# EAGLE design main (EAGLE 6.6.0)
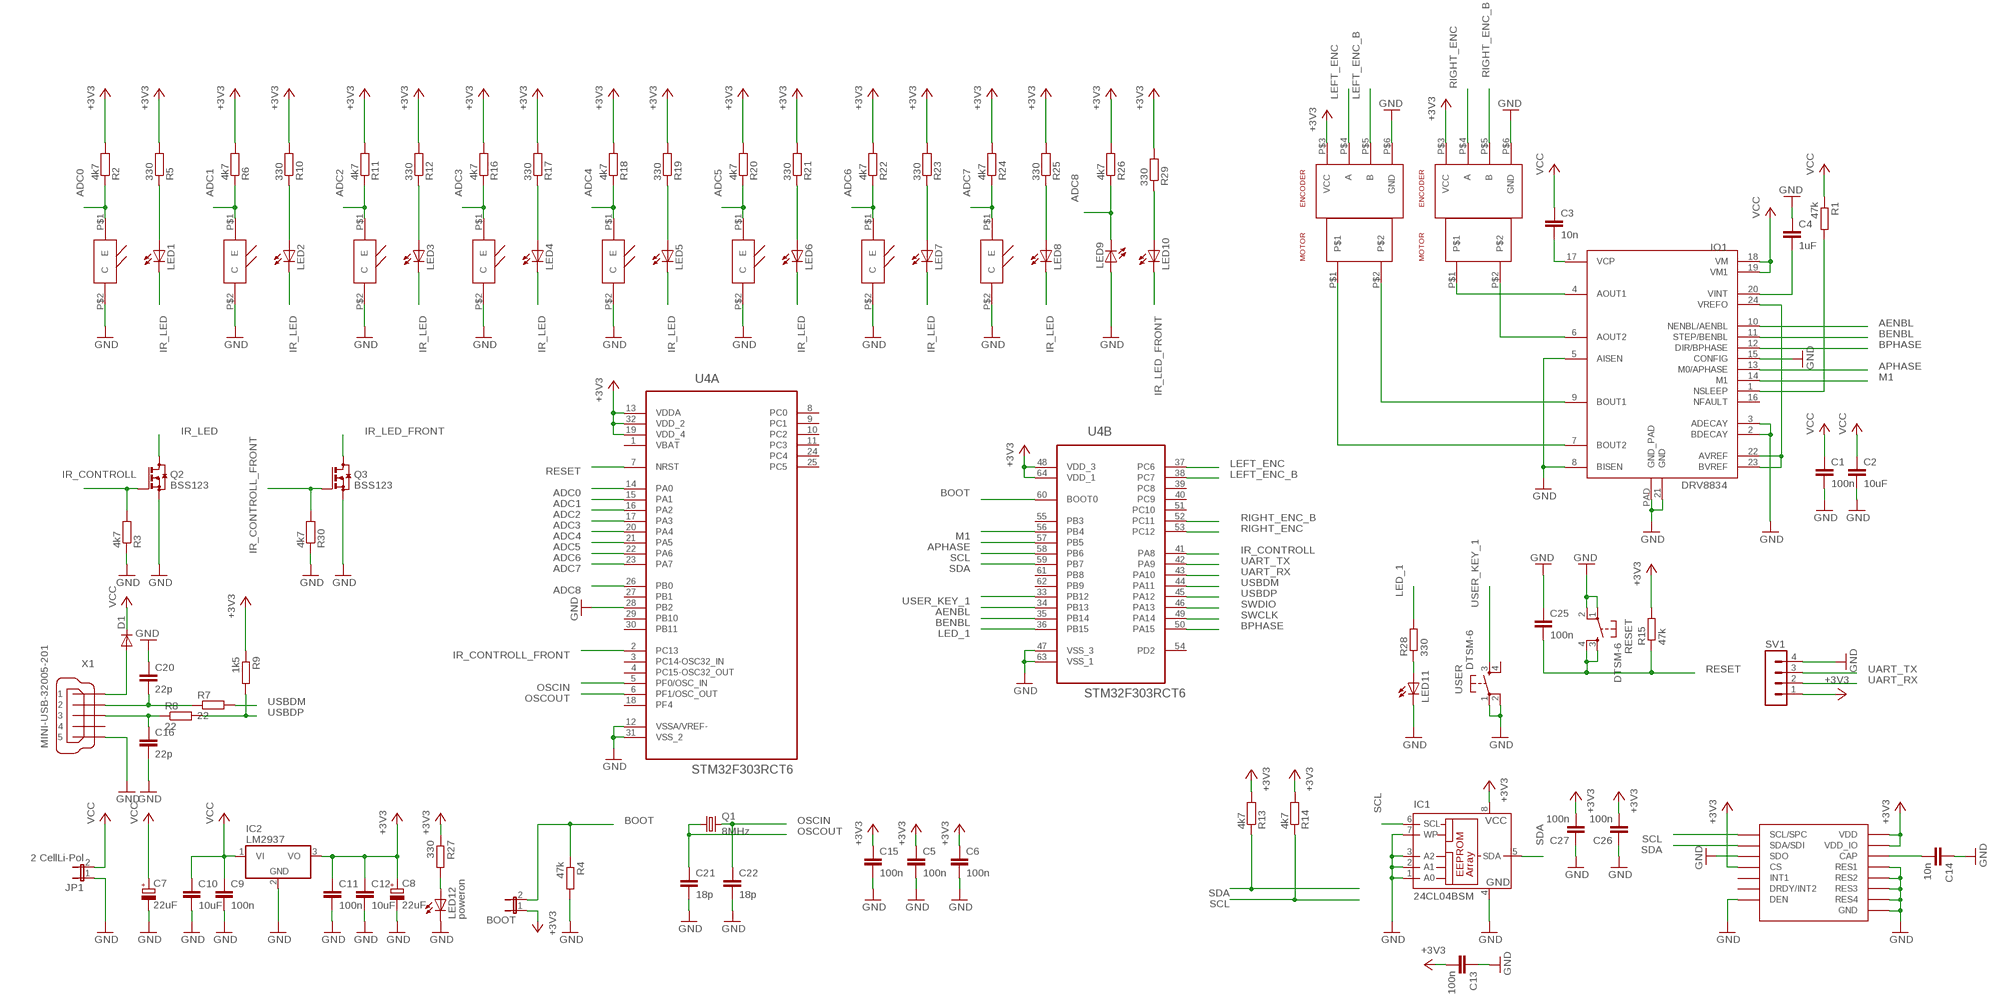
[diagram p0: schematic, sheet 1]

## Parts
BOOT  JP1E  [JP1]
C1  100n  C-EUC1206  [C1206]
C2  10uF  C-EUC1206  [C1206]
C3  10n  C-EUC1206  [C1206]
C4  1uF  C-EUC1206  [C1206]
C5  100n  C-EUC0805  [C0805]
C6  100n  C-EUC0805  [C0805]
C7  22uF  CPOL-EU153CLV-0505  [153CLV-0505]
C8  22uF  CPOL-EU153CLV-0505  [153CLV-0505]
C9  100n  C-EUC0805  [C0805]
C10  10uF  C-EUC0805  [C0805]
C11  100n  C-EUC0805  [C0805]
C12  10uF  C-EUC0805  [C0805]
C13  100n  C-EUC0805  [C0805]
C14  10n  C-EUC0805  [C0805]
C15  100n  C-EUC0805  [C0805]
C16  22p  C-EUC0805  [C0805]
C20  22p  C-EUC0805  [C0805]
C21  18p  C-EUC0805  [C0805]
C22  18p  C-EUC0805  [C0805]
C25  100n  C-EUC0805  [C0805]
C26  100n  C-EUC0805  [C0805]
C27  100n  C-EUC0805  [C0805]
D1  DIODE-SMB  [SMB]
IC1  24CL04BSM  [SO-08M]
IC2  LM2937  [TO263-3]
IO1  DRV8834  [DRV8834_PCK]
JP1  2 CellLi-Pol  JP1E  [JP1]
LED1  LEDCHIPLED_1206  [CHIPLED_1206]
LED2  LEDCHIPLED_1206  [CHIPLED_1206]
LED3  LEDCHIPLED_1206  [CHIPLED_1206]
LED4  LEDCHIPLED_1206  [CHIPLED_1206]
LED5  LEDCHIPLED_1206  [CHIPLED_1206]
LED6  LEDCHIPLED_1206  [CHIPLED_1206]
LED7  LEDCHIPLED_1206  [CHIPLED_1206]
LED8  LEDCHIPLED_1206  [CHIPLED_1206]
LED9  LED5MM  [LED5MM]
LED10  LED5MM  [LED5MM]
LED11  LEDCHIPLED_1206  [CHIPLED_1206]
LED12  poweron  LEDCHIPLED_1206  [CHIPLED_1206]
LSM6DS0  L3GD20H  [LGA16L]
Q1  8MHz  CRYSTALCTS406  [CTS406]
Q2  BSS123  [SOT23]
Q3  BSS123  [SOT23]
R1  47k  R-EU_M1206  [M1206]
R2  4k7  R-EU_M0805  [M0805]
R3  4k7  R-EU_M0805  [M0805]
R4  47k  R-EU_M0805  [M0805]
R5  330  R-EU_M0805  [M0805]
R6  4k7  R-EU_M0805  [M0805]
R7  22  R-EU_M0805  [M0805]
R8  22  R-EU_M0805  [M0805]
R9  1k5  R-EU_M0805  [M0805]
R10  330  R-EU_M0805  [M0805]
R11  4k7  R-EU_M0805  [M0805]
R12  330  R-EU_M0805  [M0805]
R13  4k7  R-EU_M0805  [M0805]
R14  4k7  R-EU_M0805  [M0805]
R15  47k  R-EU_M0805  [M0805]
R16  4k7  R-EU_M0805  [M0805]
R17  330  R-EU_M0805  [M0805]
R18  4k7  R-EU_M0805  [M0805]
R19  330  R-EU_M0805  [M0805]
R20  4k7  R-EU_M0805  [M0805]
R21  330  R-EU_M0805  [M0805]
R22  4k7  R-EU_M0805  [M0805]
R23  330  R-EU_M0805  [M0805]
R24  4k7  R-EU_M0805  [M0805]
R25  330  R-EU_M0805  [M0805]
R26  4k7  R-EU_M0805  [M0805]
R27  330  R-EU_M0805  [M0805]
R28  330  R-EU_M0805  [M0805]
R29  330  R-EU_M0805  [M0805]
R30  4k7  R-EU_M0805  [M0805]
RESET  DTSM-6  [DTSM-6]
SV1  MA04-1  [MA04-1]
U4  STM32F303RCT6  [QFP50P1200X1200X160-64N]
U$3  SFH3710  [SFH3710]
U$4  SFH3710  [SFH3710]
U$5  SFH3710  [SFH3710]
U$6  SFH3710  [SFH3710]
U$7  SFH3710  [SFH3710]
U$8  SFH3710  [SFH3710]
U$9  SFH3710  [SFH3710]
U$10  SFH3710  [SFH3710]
U$11  POLOLU_GEAR_MOTORPOLO  [POLOLU_GEAR_MOTOR]
U$12  POLOLU_GEAR_MOTORPOLO  [POLOLU_GEAR_MOTOR]
USER  DTSM-6  [DTSM-6]
X1  MINI-USB-32005-201  [32005-201]

## Nets
+3V3: BOOT.1 C5.1 C6.1 C8.+ C11.1 C12.1 C13.2 C15.1 C26.2 C27.2 IC1.8(VCC) IC2.3(VO) LSM6DS0.P$1(VDD_IO) LSM6DS0.P$5(CS) LSM6DS0.P$16(VDD) R2.2 R5.2 R6.2 R9.1 R10.2 R11.2 R12.2 R13.2 R14.2 R15.2 R16.2 R17.2 R18.2 R19.2 R20.2 R21.2 R22.2 R23.2 R24.2 R25.2 R26.2 R27.1 R29.2 SV1.1 U4.13(A:VDDA) U4.19(A:VDD_4) U4.32(A:VDD_2) U4.48(B:VDD_3) U4.64(B:VDD_1) U$11.P$3(VCC) U$12.P$3(VCC)
ADC0: R2.1 U4.14(A:PA0) U$3.P$1(E)
ADC1: R6.1 U4.15(A:PA1) U$4.P$1(E)
ADC2: R11.1 U4.16(A:PA2) U$5.P$1(E)
ADC3: R16.1 U4.17(A:PA3) U$6.P$1(E)
ADC4: R18.1 U4.20(A:PA4) U$7.P$1(E)
ADC5: R20.1 U4.21(A:PA5) U$8.P$1(E)
ADC6: R22.1 U4.22(A:PA6) U$9.P$1(E)
ADC7: R24.1 U4.23(A:PA7) U$10.P$1(E)
ADC8: LED9.K(C) R26.1 U4.26(A:PB0)
AENBL: IO1.10(NENBL/AENBL) U4.34(B:PB13)
APHASE: IO1.13(M0/APHASE) U4.57(B:PB5)
BENBL: IO1.11(STEP/BENBL) U4.35(B:PB14)
BOOT: BOOT.2 R4.1 U4.60(B:BOOT0)
BPHASE: IO1.12(DIR/BPHASE) U4.50(B:PA15)
GND: C1.2 C2.2 C4.1 C5.2 C6.2 C7.- C8.- C9.2 C10.2 C11.2 C12.2 C13.1 C14.1 C15.2 C16.2 C20.1 C21.2 C22.2 C25.1 C26.1 C27.1 IC1.1(A0) IC1.2(A1) IC1.3(A2) IC1.4(GND) IC1.7(WP) IC2.2(GND) IO1.2(BDECAY) IO1.3(ADECAY) IO1.5(AISEN) IO1.8(BISEN) IO1.15(CONFIG) IO1.21(GND) IO1.PAD(GND_PAD) JP1.1 LED9.A LED11.C LED12.C LSM6DS0.P$4(SDO) LSM6DS0.P$8(DEN) LSM6DS0.P$9(RES1) LSM6DS0.P$10(RES2) LSM6DS0.P$11(RES3) LSM6DS0.P$12(GND) LSM6DS0.P$13(GND) LSM6DS0.P$15(RES4) Q2.2(S) Q3.2(S) R3.1 R4.2 R30.1 RESET.1 RESET.2 SV1.4 U4.12(A:VSSA/VREF-) U4.28(A:PB2) U4.31(A:VSS_2) U4.47(B:VSS_3) U4.63(B:VSS_1) U$3.P$2(C) U$4.P$2(C) U$5.P$2(C) U$6.P$2(C) U$7.P$2(C) U$8.P$2(C) U$9.P$2(C) U$10.P$2(C) U$11.P$6(GND) U$12.P$6(GND) USER.1 USER.2 X1.5
IR_CONTROLL: Q2.1(G) R3.2 U4.41(B:PA8)
IR_CONTROLL_FRONT: Q3.1(G) R30.2 U4.2(A:PC13)
IR_LED: LED1.C LED2.C LED3.C LED4.C LED5.C LED6.C LED7.C LED8.C Q2.3(D)
IR_LED_FRONT: LED10.K(C) Q3.3(D)
LED_1: R28.2 U4.36(B:PB15)
LEFT_ENC: U4.37(B:PC6) U$11.P$4(A)
LEFT_ENC_B: U4.38(B:PC7) U$11.P$5(B)
M1: IO1.14(M1) U4.56(B:PB4)
N$1: IO1.6(AOUT2) U$12.P$2
N$2: IO1.4(AOUT1) U$12.P$1
N$3: IO1.7(BOUT2) U$11.P$1
N$4: IO1.9(BOUT1) U$11.P$2
N$5: C3.2 IO1.17(VCP)
N$6: C14.2 LSM6DS0.P$14(CAP)
N$7: LED10.A R29.1
N$8: IO1.22(AVREF) IO1.23(BVREF) IO1.24(VREFO)
N$9: IO1.1(NSLEEP) R1.2
N$14: LED1.A R5.1
N$15: LED2.A R10.1
N$16: LED3.A R12.1
N$17: LED4.A R17.1
N$18: LED5.A R19.1
N$19: LED6.A R21.1
N$20: LED7.A R23.1
N$21: LED8.A R25.1
N$22: C4.2 IO1.20(VINT)
N$23: LED12.A R27.2
N$33: LED11.A R28.1
N$55: C20.2 R7.1 X1.2
N$56: C16.1 R8.1 X1.3
N$57: D1.A X1.1
OSCIN: C22.1 Q1.3 U4.5(A:PF0/OSC_IN)
OSCOUT: C21.1 Q1.1 U4.6(A:PF1/OSC_OUT)
RESET: C25.2 R15.1 RESET.3 RESET.4 U4.7(A:NRST)
RIGHT_ENC: U4.53(B:PC12) U$12.P$4(A)
RIGHT_ENC_B: U4.52(B:PC11) U$12.P$5(B)
SCL: IC1.6(SCL) LSM6DS0.P$2(SCL/SPC) R14.1 U4.58(B:PB6)
SDA: IC1.5(SDA) LSM6DS0.P$3(SDA/SDI) R13.1 U4.59(B:PB7)
SWCLK: U4.49(B:PA14)
SWDIO: U4.46(B:PA13)
UART_RX: SV1.2 U4.43(B:PA10)
UART_TX: SV1.3 U4.42(B:PA9)
USBDM: R7.2 U4.44(B:PA11)
USBDP: R8.2 R9.2 U4.45(B:PA12)
USER_KEY_1: U4.33(B:PB12) USER.3
VCC: C1.1 C2.1 C3.1 C7.+ C9.1 C10.1 D1.C IC2.1(VI) IO1.18(VM) IO1.19(VM1) JP1.2 R1.1
Unconnected: IO1.16(NFAULT) LSM6DS0.P$6(DRDY/INT2) LSM6DS0.P$7(INT1) U4.3(A:PC14-OSC32_IN) U4.4(A:PC15-OSC32_OUT) U4.8(A:PC0) U4.9(A:PC1) U4.10(A:PC2) U4.11(A:PC3) U4.18(A:PF4) U4.24(A:PC4) U4.25(A:PC5) U4.27(A:PB1) U4.29(A:PB10) U4.30(A:PB11) U4.39(B:PC8) U4.40(B:PC9) U4.51(B:PC10) U4.54(B:PD2) U4.55(B:PB3) U4.61(B:PB8) U4.62(B:PB9) USER.4 X1.4

## Power pins joined to a net without a drawn wire
VBAT: U4.1(A:VBAT)

## Library data of the parts
BOOT JP1 = jumper:JP1E: JUMPER
C1-C6 C9-C16 C20-C22 C25-C27 = resistor:C-EU: CAPACITOR, European symbol
C7 C8 = resistor:CPOL-EU: POLARIZED CAPACITOR, European symbol
D1 = diode:DIODE-: DIODE
IC1 = microchip:24*: Serial EEPROM I2C; MPN: FM24CL04-S; OC_FARNELL: 1607928; OC_NEWARK: 97H6443
IC2 = linear:LM2937: LM2937-2.5, LM2937-3.3 400mA and 500mA Voltage Regulators Source: http://cache.national.com/ds/LM/LM2937-2.5.pdf
IO1 = yellow_car:DRV8834
LED1-LED8 LED11 LED12 = led:LED: LED OSRAM: - CHIPLED LG R971, LG N971, LY N971, LG Q971, LY Q971, LO R971, LY R971 LH N974, LH R974 LS Q976, LO Q976, LY Q976 LO Q996 - Hyper CHIPLED LW Q18S LB Q993, LB Q99A, LB R99A - SideLED LS A670, LO A670, LY A670, LG A670, LP A670 LB A673, LV A673, LT A673, LW A673 LH A674 LY A675 LS A676, LA A676, LO A676, LY A676, LW A676 LS A679, LY A679, LG A679 - Hyper Micro SIDELED® LS Y876, LA Y876, LO Y876, LY Y876 LT Y87S - SmartLED LW L88C, LW L88S LB L89C, LB L89S, LG L890 LS L89K, LO L89K, LY L89K LS L896, LA L896, LO L896, LY L896 - TOPLED LS T670, LO T670, LY T670, LG T670, LP T670 LSG T670, LSP T670, LSY T670, LOP T670, LYG T670 LG T671, LOG T671, LSG T671 LB T673, LV T673, LT T673, LW T673 LH T674 LS T676, LA T676, LO T676, LY T676, LB T676, LH T676, LSB T676, LW T676 LB T67C, LV T67C, LT T67C, LS T67K, LO T67K, LY T67K, LW E67C LS E67B, LA E67B, LO E67B, LY E67B, LB E67C, LV E67C, LT E67C LW T67C LS T679, LY T679, LG T679 LS T770, LO T770, LY T770, LG T770, LP T770 LB T773, LV T773, LT T773, LW T773 LH T774 LS E675, LA E675, LY E675, LS T675 LS T776, LA T776, LO T776, LY T776, LB T776 LHGB T686 LT T68C, LB T68C - Hyper Mini TOPLED® LB M676 - Mini TOPLED Santana® LG M470 LS M47K, LO M47K, LY M47K Source: http://www.osram.convergy.de LUXEON: - LUMILED® LXK2-PW12-R00, LXK2-PW12-S00, LXK2-PW14-U00, LXK2-PW14-V00 LXK2-PM12-R00, LXK2-PM12-S00, LXK2-PM14-U00 LXK2-PE12-Q00, LXK2-PE12-R00, LXK2-PE12-S00, LXK2-PE14-T00, LXK2-PE14-U00 LXK2-PB12-K00, LXK2-PB12-L00, LXK2-PB12-M00, LXK2-PB14-N00, LXK2-PB14-P00, LXK2-PB14-Q00 LXK2-PR12-L00, LXK2-PR12-M00, LXK2-PR14-Q00, LXK2-PR14-R00 LXK2-PD12-Q00, LXK2-PD12-R00, LXK2-PD12-S00 LXK2-PH12-R00, LXK2-PH12-S00 LXK2-PL12-P00, LXK2-PL12-Q00, LXK2-PL12-R00 Source: www.luxeon.com KINGBRIGHT: KA-3528ASYC Source: www.kingbright.com
LED9 LED10 = my_parts:LED: LED OSRAM: - CHIPLED LG R971, LG N971, LY N971, LG Q971, LY Q971, LO R971, LY R971 LH N974, LH R974 LS Q976, LO Q976, LY Q976 LO Q996 - Hyper CHIPLED LW Q18S LB Q993, LB Q99A, LB R99A - SideLED LS A670, LO A670, LY A670, LG A670, LP A670 LB A673, LV A673, LT A673, LW A673 LH A674 LY A675 LS A676, LA A676, LO A676, LY A676, LW A676 LS A679, LY A679, LG A679 - Hyper Micro SIDELED® LS Y876, LA Y876, LO Y876, LY Y876 LT Y87S - SmartLED LW L88C, LW L88S LB L89C, LB L89S, LG L890 LS L89K, LO L89K, LY L89K LS L896, LA L896, LO L896, LY L896 - TOPLED LS T670, LO T670, LY T670, LG T670, LP T670 LSG T670, LSP T670, LSY T670, LOP T670, LYG T670 LG T671, LOG T671, LSG T671 LB T673, LV T673, LT T673, LW T673 LH T674 LS T676, LA T676, LO T676, LY T676, LB T676, LH T676, LSB T676, LW T676 LB T67C, LV T67C, LT T67C, LS T67K, LO T67K, LY T67K, LW E67C LS E67B, LA E67B, LO E67B, LY E67B, LB E67C, LV E67C, LT E67C LW T67C LS T679, LY T679, LG T679 LS T770, LO T770, LY T770, LG T770, LP T770 LB T773, LV T773, LT T773, LW T773 LH T774 LS E675, LA E675, LY E675, LS T675 LS T776, LA T776, LO T776, LY T776, LB T776 LHGB T686 LT T68C, LB T68C - Hyper Mini TOPLED® LB M676 - Mini TOPLED Santana® LG M470 LS M47K, LO M47K, LY M47K Source: http://www.osram.convergy.de LUXEON: - LUMILED® LXK2-PW12-R00, LXK2-PW12-S00, LXK2-PW14-U00, LXK2-PW14-V00 LXK2-PM12-R00, LXK2-PM12-S00, LXK2-PM14-U00 LXK2-PE12-Q00, LXK2-PE12-R00, LXK2-PE12-S00, LXK2-PE14-T00, LXK2-PE14-U00 LXK2-PB12-K00, LXK2-PB12-L00, LXK2-PB12-M00, LXK2-PB14-N00, LXK2-PB14-P00, LXK2-PB14-Q00 LXK2-PR12-L00, LXK2-PR12-M00, LXK2-PR14-Q00, LXK2-PR14-R00 LXK2-PD12-Q00, LXK2-PD12-R00, LXK2-PD12-S00 LXK2-PH12-R00, LXK2-PH12-S00 LXK2-PL12-P00, LXK2-PL12-Q00, LXK2-PL12-R00 Source: www.luxeon.com KINGBRIGHT: KA-3528ASYC Source: www.kingbright.com
LSM6DS0 = st:L3GD20H
Q1 = crystal:CRYSTAL: CRYSTAL; OC_FARNELL: unknown; OC_NEWARK: unknown
Q2 Q3 = transistor-small-signal:BSS123: N-CHANNEL MOS FET
R1-R30 = resistor:R-EU_: RESISTOR, European symbol
RESET USER = switch-tact:DTSM-6
SV1 = con-lstb:MA04-1: PIN HEADER; OC_FARNELL: unknown; OC_NEWARK: unknown
U4 = my_parts:STM32F303RCT6: ARM Cortex-M4 32b MCU+FPU,LQFP-64; MPN: STM32F303RCT6; OC_FARNELL: 2215112; OC_NEWARK: 46W2193; PACKAGE: LQFP-64; SUPPLIER: STMICROELECTRONICS
U$3-U$10 = my_parts:SFH3710
U$11 U$12 = my_parts:POLOLU_GEAR_MOTOR
X1 = con-cypressindustries:MINI-USB-: MINI USB-B Conector Source: www.cypressindustries.com; OC_FARNELL: unknown; OC_NEWARK: unknown

## Board
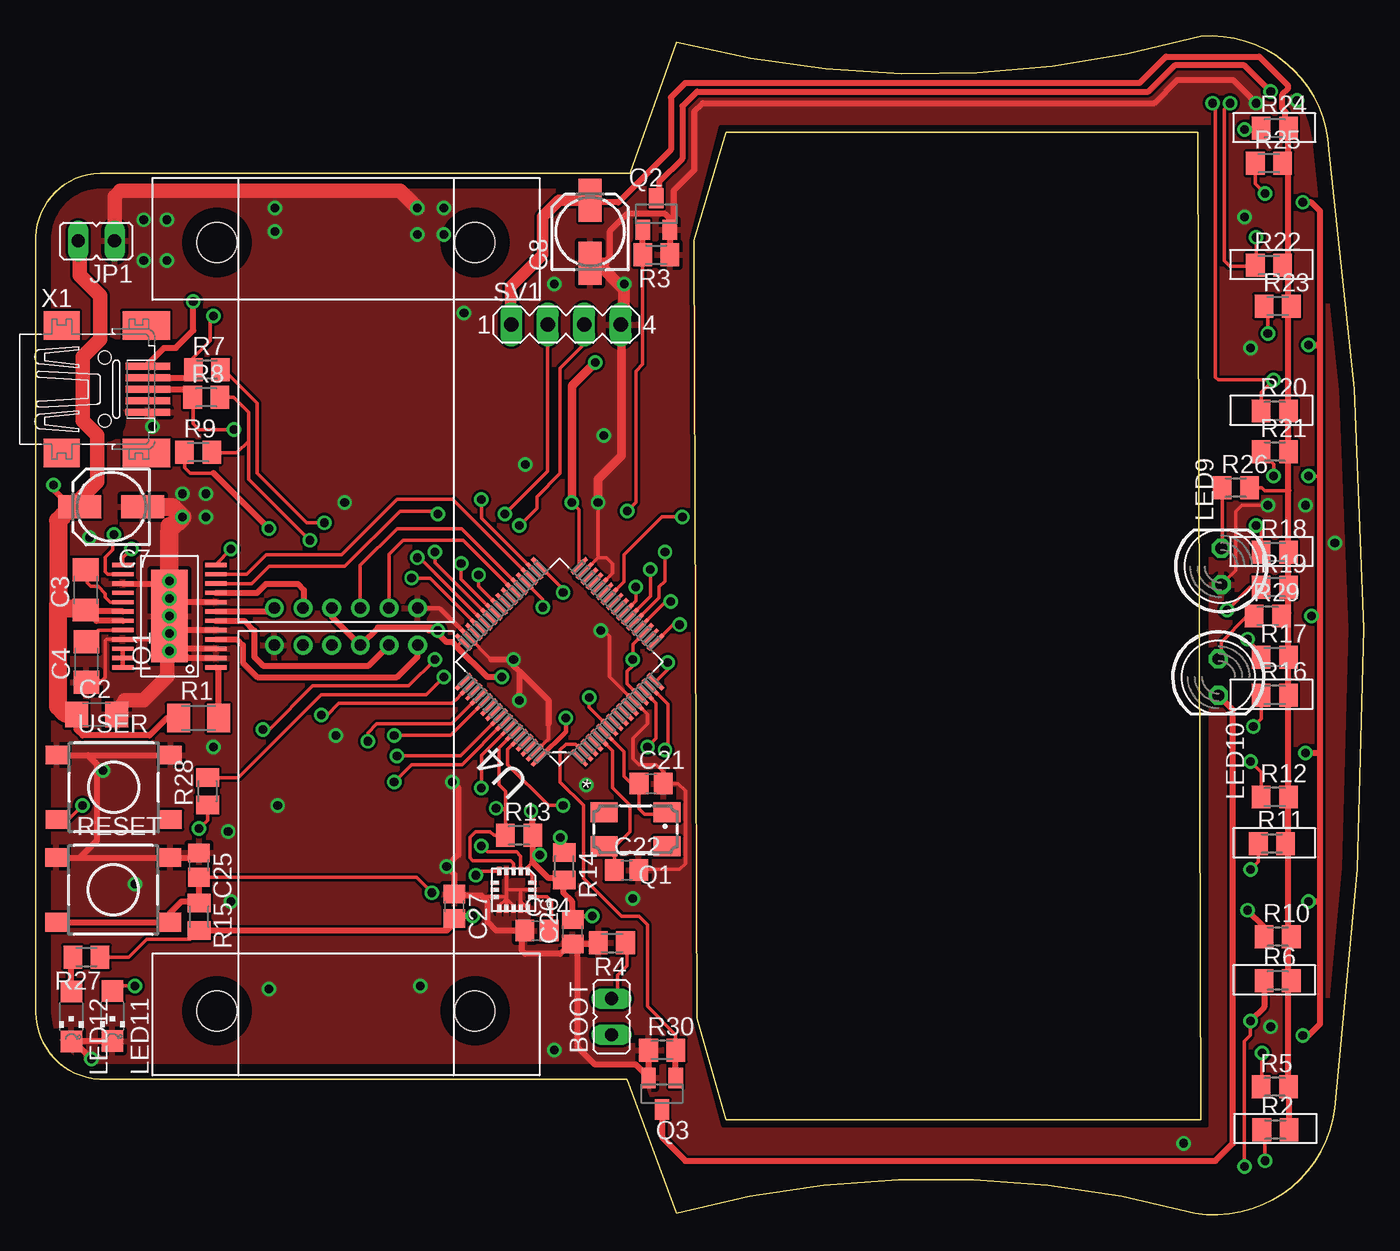
[diagram p1: board, top side]
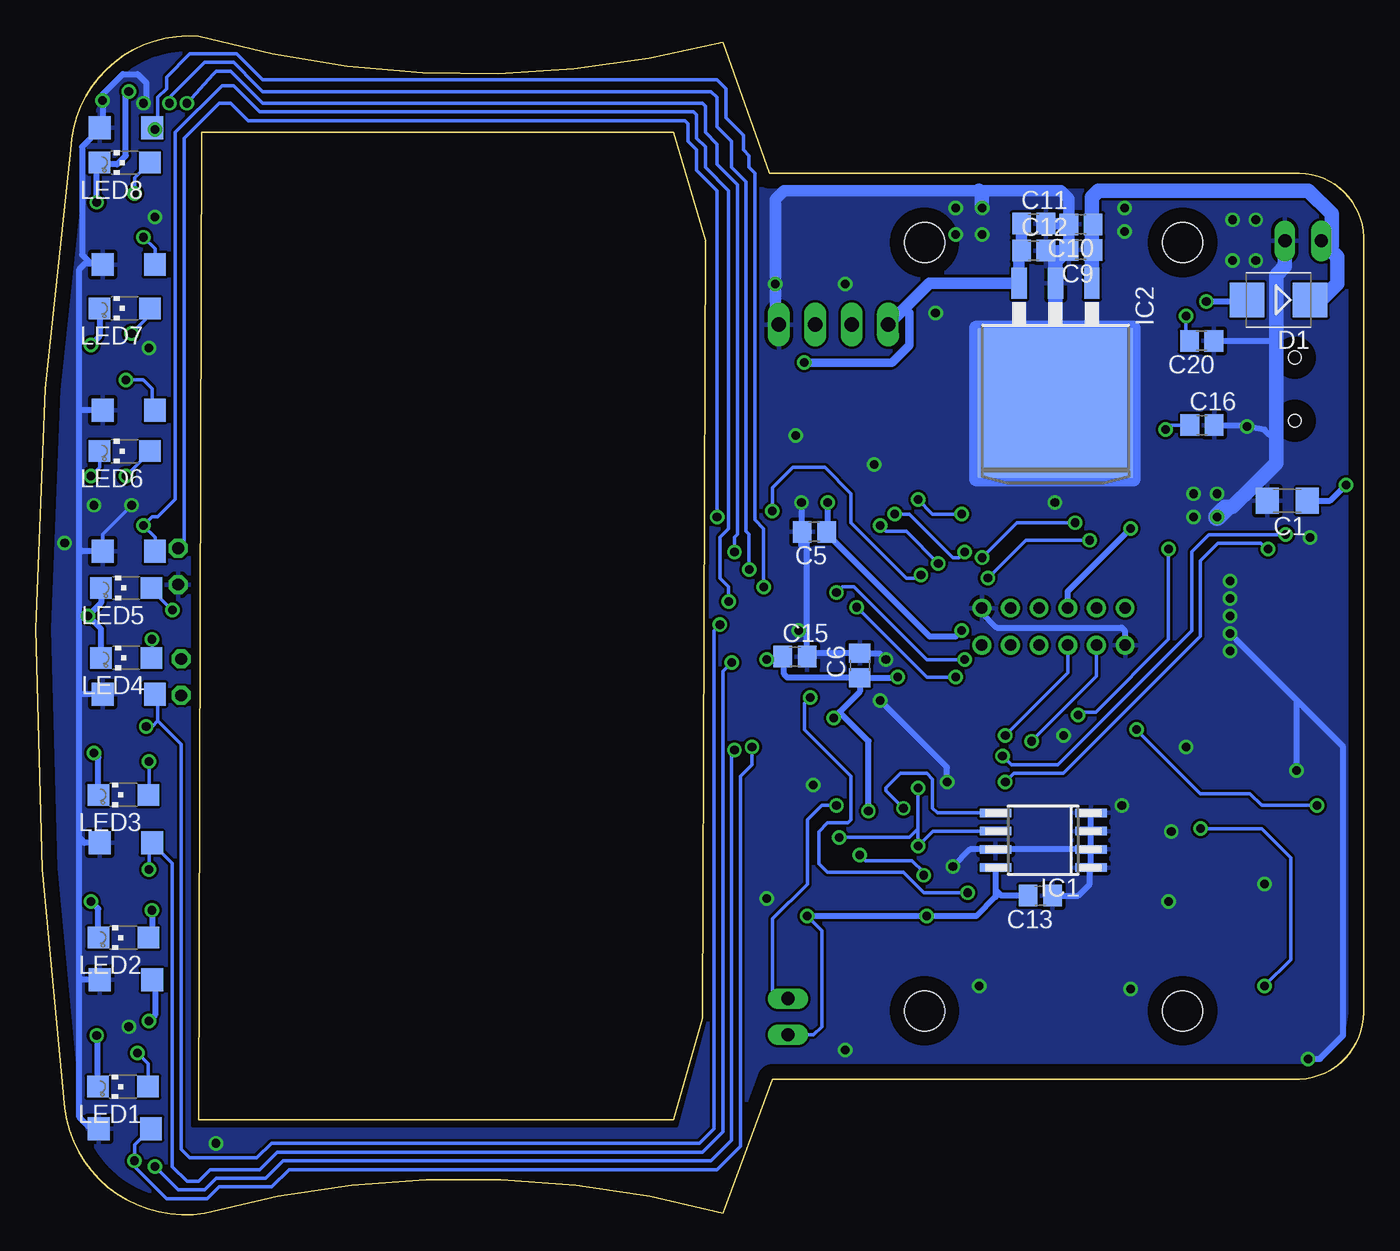
[diagram p2: board, bottom side, seen from below]

Size 92.65 x 82.23 mm. Coordinates in mm from the lower left corner, seen from the top.
Outline: 0.01,67.77 0.01,14.13 arc92 4.88,9.46 41.26,9.46 44.71,0.11 arc-30 80.88,0.11 arc92 90.63,7.42 arc15 90.23,74.28 arc92 81.29,82.2 arc-30 44.71,81.79 41.46,72.65 4.48,72.65 arc92 0.01,67.77
Copper layers (1*16): Top 0.035mm / dielectric 1.5mm / Bottom 0.035mm
Design rules "default *": minimum track width 8mil, minimum drill 24mil, track to track 7mil, track to pad 7mil, pad to pad 7mil, via to via 7mil, smd to smd 7mil, copper to edge 40mil, drill to drill 8mil, minimum pad ring 10mil, minimum via ring 8mil, stop-mask expansion 4mil, vias tented up to drill 0mil, thermal gap 10mil
tRestrict: area 45.7,6.2 to 81.7,75.9
bRestrict: area 45.7,6.2 to 81.7,75.9
Milling: area 45.9,6.6 to 81.3,75.5

### Footprints (pad centres in the part's own frame; a part is rotated, then mirrored left to right if it is on the bottom)
JP1 = drill 0.914 long: 1 0,-1.27; 2 0,1.27
C1206 = smd 1.6 x 1.8: 1 -1.4,0; 2 1.4,0
C0805 = smd 1.3 x 1.5: 1 -0.85,0; 2 0.85,0
153CLV-0505 = smd 3 x 1.6: + 2.2,0; - -2.2,0
SMB = smd 2.4 x 2.4: A 2.2,0; C -2.2,0
SO-08M = smd 0.6 x 2.2: 1 -1.905,-3.33; 2 -0.635,-3.33; 3 0.635,-3.33; 4 1.905,-3.33; 5 1.905,3.33; 6 0.635,3.33; 7 -0.635,3.33; 8 -1.905,3.33
TO263-3 = smd 1.067 x 2.159: 1 -2.54,-5.791; 2 0,-5.791; 3 2.54,-5.791 | smd 10.8 x 10.41: TAB 0,2.54
DRV8834_PCK = smd 0.3 x 1.5: 1 -3.575,-3.25; 2 -2.925,-3.25; 3 -2.275,-3.25; 4 -1.625,-3.25; 5 -0.975,-3.25; 6 -0.325,-3.25; 7 0.325,-3.25; 8 0.975,-3.25; 9 1.625,-3.25; 10 2.275,-3.25; 11 2.925,-3.25; 12 3.575,-3.25; 13 3.575,3.25; 14 2.925,3.25; 15 2.275,3.25; 16 1.625,3.25; 17 0.975,3.25; 18 0.325,3.25; 19 -0.325,3.25; 20 -0.975,3.25; 21 -1.625,3.25; 22 -2.275,3.25; 23 -2.925,3.25; 24 -3.575,3.25 | smd 6.452 x 2.54: PAD 0,0
CHIPLED_1206 = smd 1.5 x 1.5: A 0,-1.75; C 0,1.75
LED5MM = drill 0.813 octagon: A -1.27,0; K 1.27,0
LGA16L = smd 0.6 x 0.3: P$1 -1.3,1; P$2 -1.3,0.5; P$3 -1.3,0; P$4 -1.3,-0.5; P$5 -1.3,-1; P$9 1.3,-1; P$10 1.3,-0.5; P$11 1.3,0; P$12 1.3,0.5; P$13 1.3,1 | smd 0.3 x 0.6: P$6 -0.5,-1.3; P$7 0,-1.3; P$8 0.5,-1.3; P$14 0.5,1.3; P$15 0,1.3; P$16 -0.5,1.3
CTS406 = smd 1.9 x 1.4: 1 -2.2,-1.2; 2 2.2,-1.2; 3 2.2,1.2; 4 -2.2,1.2
SOT23 = smd 1 x 1.4: 1 -0.95,-1.1; 2 0.95,-1.1; 3 0,1.1
M1206 = smd 1.6 x 2: 1 -1.4,0; 2 1.4,0
M0805 = smd 1.3 x 1.6: 1 -0.95,0; 2 0.95,0
DTSM-6 = smd 1.55 x 1.3: 1 -3.975,2.25; 2 3.975,2.25; 3 -3.975,-2.25; 4 3.975,-2.25
MA04-1 = drill 1.016 long: 1 -3.81,0; 2 -1.27,0; 3 1.27,0; 4 3.81,0
QFP50P1200X1200X160-64N = smd 1.473 x 0.279: 1 -5.715,3.759; 2 -5.715,3.251; 3 -5.715,2.743; 4 -5.715,2.261; 5 -5.715,1.753; 6 -5.715,1.245; 7 -5.715,0.762; 8 -5.715,0.254; 9 -5.715,-0.254; 10 -5.715,-0.762; 11 -5.715,-1.245; 12 -5.715,-1.753; 13 -5.715,-2.261; 14 -5.715,-2.743; 15 -5.715,-3.251; 16 -5.715,-3.759; 33 5.715,-3.759; 34 5.715,-3.251; 35 5.715,-2.743; 36 5.715,-2.261; 37 5.715,-1.753; 38 5.715,-1.245; 39 5.715,-0.762; 40 5.715,-0.254; 41 5.715,0.254; 42 5.715,0.762; 43 5.715,1.245; 44 5.715,1.753; 45 5.715,2.261; 46 5.715,2.743; 47 5.715,3.251; 48 5.715,3.759 | smd 0.279 x 1.473: 17 -3.759,-5.715; 18 -3.251,-5.715; 19 -2.743,-5.715; 20 -2.261,-5.715; 21 -1.753,-5.715; 22 -1.245,-5.715; 23 -0.762,-5.715; 24 -0.254,-5.715; 25 0.254,-5.715; 26 0.762,-5.715; 27 1.245,-5.715; 28 1.753,-5.715; 29 2.261,-5.715; 30 2.743,-5.715; 31 3.251,-5.715; 32 3.759,-5.715; 49 3.759,5.715; 50 3.251,5.715; 51 2.743,5.715; 52 2.261,5.715; 53 1.753,5.715; 54 1.245,5.715; 55 0.762,5.715; 56 0.254,5.715; 57 -0.254,5.715; 58 -0.762,5.715; 59 -1.245,5.715; 60 -1.753,5.715; 61 -2.261,5.715; 62 -2.743,5.715; 63 -3.251,5.715; 64 -3.759,5.715
SFH3710 = smd 1.52 x 1.6: P$1 -1.75,0; P$2 1.9,0
POLOLU_GEAR_MOTOR = drill 0.8: P$1 -5,-14.5; P$2 -3,-14.5; P$3 -1,-14.5; P$4 1,-14.5; P$5 3,-14.5; P$6 5,-14.5 | hole 2.8: -9,11; 9,11
32005-201 = smd 3.1 x 0.5: 1 3,1.6; 2 3,0.8; 3 3,0; 4 3,-0.8; 5 3,-1.6 | smd 2.5 x 2: M1 -3,-4.45; M2 -3,4.45 | smd 3.3 x 2: M3 2.9,4.45; M4 2.9,-4.45 | hole 0.9: 0,2.2; 0,-2.2

### Placement (x,y rotation side)
BOOT  40.17,13.81 0 top
C1  5.32,49.8 180 bottom
C2  4.24,34.9 0 top
C3  3.48,43.58 90 top
C4  3.53,38.55 90 top
C5  38.32,47.64 180 bottom
C6  35.16,38.31 90 bottom
C7  5.26,49.37 180 top
C8  38.68,68.56 90 top
C9  19.72,67.29 180 bottom
C10  19.72,69.07 180 bottom
C11  23.03,69.12 0 bottom
C12  23.03,67.24 0 bottom
C13  22.56,22.26 180 bottom
C14  34.96,19.82 0 top
C15  39.69,38.92 0 bottom
C16  11.28,55.08 0 bottom
C20  11.31,60.96 180 bottom
C21  42.94,30.07 0 top
C22  41.21,24.03 0 top
C25  11.38,24.39 270 top
C26  37.46,19.75 90 top
C27  29.2,21.52 270 top
D1  5.94,63.81 180 bottom
IC1  22.36,26.12 90 bottom
IC2  21.5,59.17 180 bottom
IO1  9.32,41.75 90 top
JP1  4.22,67.92 90 top
LED1  86.57,8.93 90 bottom
LED2  86.54,19.33 90 bottom
LED3  86.54,29.29 90 bottom
LED4  86.34,38.84 90 bottom
LED5  86.34,43.72 90 bottom
LED6  86.44,53.27 90 bottom
LED7  86.44,63.22 90 bottom
LED8  86.44,73.38 90 bottom
LED9  82.71,45.22 90 top
LED10  82.51,37.5 270 top
LED11  5.35,13.86 180 top
LED12  2.47,13.83 180 top
LSM6DS0  33.33,22.66 270 top
Q1  41.84,26.89 180 top
Q2  43.29,69.81 0 top
Q3  43.7,8.44 180 top
R1  11.35,34.64 0 top
R2  86.49,5.93 0 top
R3  43.29,66.96 180 top
R4  40.2,18.96 180 top
R5  86.45,8.92 0 top
R6  86.65,16.34 0 top
R7  11.94,58.94 0 top
R8  11.89,57.01 0 top
R9  11.33,53.19 0 top
R10  86.65,19.38 0 top
R11  86.24,25.89 0 top
R12  86.45,29.14 0 top
R13  33.72,26.46 0 top
R14  36.87,24.31 270 top
R15  11.39,20.79 270 top
R16  86.45,36.25 0 top
R17  86.45,38.89 0 top
R18  86.45,46.21 0 top
R19  86.45,43.77 0 top
R20  86.45,56.06 0 top
R21  86.45,53.22 0 top
R22  86.04,66.22 0 top
R23  86.65,63.38 0 top
R24  86.45,75.77 0 top
R25  86.04,73.33 0 top
R26  83.73,50.71 0 top
R27  3.53,17.97 180 top
R28  11.98,29.54 90 top
R29  85.96,41.76 0 top
R30  43.7,11.49 0 top
RESET  5.4,22.66 0 top
SV1  36.99,62.08 0 top
U4  36.54,38.56 135 top
U$3  86.37,6.01 180 bottom
U$4  86.29,16.39 180 bottom
U$5  86.29,25.94 180 bottom
U$6  86.08,36.31 180 bottom
U$7  86.08,46.26 180 bottom
U$8  86.08,56.12 180 bottom
U$9  86.08,66.28 180 bottom
U$10  86.29,75.83 180 bottom
U$11  21.64,56.82 0 top
U$12  21.64,25.22 180 top
USER  5.44,29.81 0 top
X1  4.81,57.59 0 top

### Tracks (layer width: path | path; a pad name or v marks a point on that pad's centre or on a via)
+3V3  (via drill 0.6)
  Top 0.254: R27.1 6.49,17.97 7.73,19.21 10.76,19.21 R15.2 | R9.1 10.38,52.12 10.78,51.72 12.4,51.72 | U4.32 37.92,49.17 v37.4,49.69 | U4.19 41.66,39.81 v41.66,38.72 41.66,38.31 41.26,37.9 41.26,37.03 U4.13 | R25.2 87.12,73.33 87.4,73.06 | R24.2 87.4,75.51 87.38,75.5 | 36.79,23.27 R14.2 | 37.17,22.08 37.4,21.85 | 36.79,23.27 | R26.2 85.55,50.71 85.76,50.5 87.4,50.5 | R29.2 86.91,41.89 87.19,42.17 | 34.75,24.7 34.65,24.59 34.33,24.27 LSM6DS0.P$1 34.63,23.66 LSM6DS0.P$16 | U4.48 29.68,39.94 29.37,39.63 | LSM6DS0.P$5 30.97,23.96 v30.69,23.68 | v35.16,25.1 34.67,25.1
  Top 0.305: v36.99,34.65 36.99,33.7 U4.64 | v38.82,20.83 37.7,20.83 C26.2
  Top 0.406: U$11.P$3 20.64,41.72 U$12.P$3 23.87,40.95 27.24,40.95 | C8.+ 38.82,70.62 40.65,70.62 44.3,74.28 44.3,77.93 45.32,78.95 77.02,78.95 78.85,80.78 85.35,80.78 87.38,78.75 87.38,78.54 86.98,78.14 86.98,77.12 87.18,76.92 87.18,75.99 R24.2 87.4,73.06 87.4,66.35 | 27.24,40.95 27.64,40.95 28.65,39.94 29.06,39.94 29.37,39.63 31.51,37.5 v32.52,37.5 | v16.26,47.86 12.4,51.72 | v28.05,40.75 27.44,40.75 27.24,40.95 | 33.33,64.12 33.13,63.91 | R2.2 87.44,8.88 R5.2 87.4,16.36 | 87.4,16.36 87.4,19.01 | 87.4,19.01 87.4,25.91 | 87.4,25.91 R12.2 R16.2 R17.2 87.4,41.97 | 87.4,41.97 R19.2 R18.2 87.4,50.5 R21.2 R20.2 87.4,63.91 | R11.2 87.37,25.89 87.4,25.91 | R10.2 87.6,19.21 87.4,19.01 | R6.2 87.43,16.34 87.4,16.36 | 87.4,63.91 87.4,66.35 | R22.2 87.27,66.22 87.4,66.35 | R23.2 87.6,63.71 87.4,63.91 | 87.19,42.17 87.4,41.97 | 87.38,75.5 87.38,76.11 | v34.55,28.15 34.67,28.03 R13.2 34.67,25.1 34.67,24.78 34.75,24.7 | 36.79,23.27 36.79,22.46 37.4,21.85 37.4,20.66 C26.2 | R14.2 36.76,23.48 35.77,23.48 34.65,24.59 | 30.69,20.83 v30.49,20.83 29.67,20.83 | R15.2 28.68,19.84 29.67,20.83 | 29.67,20.83 29.37,20.83 C27.2
  Top 0.61: v37.4,49.69 37.4,57.82 v39.02,59.44
  Top 0.813: C8.+ 36.52,70.76 35.36,69.6 35.36,66.96 33.13,64.73 33.13,63.91 33.13,62.14 SV1.1
  Bottom 0.254: v37.4,49.69 37.4,47.71 C5.1 | C15.1 41.46,38.92 v41.66,38.72 | BOOT.1 38.37,12.54 37.8,13.11 37.8,19.82 v38.82,20.83 | v30.69,23.68 30.69,23.88 31.5,24.7 34.75,24.7 v35.16,25.1
  Bottom 0.406: U$11.P$3 20.64,43.48 v16.26,47.86 | v37.4,49.69 37.4,47.45 30.28,40.34 28.46,40.34 v28.05,40.75 | C6.1 40.2,37.46 40.44,37.7 40.44,38.83 C15.1 | C6.1 32.56,37.46 v32.52,37.5 | C6.1 35.16,36.48 36.58,35.06 | 36.58,35.06 v36.99,34.65 | v34.55,28.15 34.55,33.03 36.58,35.06 | IC1.8 25.69,22.66 | 25.69,22.66 25.69,22.18 27.03,20.83 v30.49,20.83 v38.82,20.83 | C13.2 25.28,22.26 25.69,22.66
  Bottom 0.61: v39.02,59.44 32.93,59.44 31.71,60.66 31.71,62.9 32.04,63.23
  Bottom 0.813: C11.1 C12.1 24.04,67.08 IC2.3 30.31,64.96 32.04,63.23 SV1.1
ADC0  (via drill 0.6)
  Top 0.254: U4.14 43.29,35.69 43.29,33.23 v42.68,32.62 | v85.76,3.77 85.76,5.71 R2.1
  Bottom 0.254: v42.68,32.62 42.68,31.4 43.49,30.59 43.49,4.78 45.12,3.16 74.99,3.16 76.21,1.94 79.86,1.94 80.68,1.12 83.52,1.12 85.76,3.36 v85.76,3.77 85.76,4.87 U$3.P$1
ADC1  (via drill 0.6)
  Top 0.254: U4.15 44.1,35.59 44.1,32.62 v43.9,32.42 | R6.1 85.7,15.9 | v84.74,13.52 84.74,12.5 84.34,12.1 v84.34,3.36
  Top 0.406: 85.7,15.9 85.7,14.48 v84.74,13.52
  Bottom 0.254: v43.9,32.42 44.1,32.21 44.1,5.19 45.52,3.77 75.39,3.77 76.61,2.55 80.07,2.55 80.88,1.73 82.71,1.73 v84.34,3.36 | 84.34,16.19 U$4.P$1
  Bottom 0.406: 84.34,16.19 84.34,13.93 v84.74,13.52
ADC2  (via drill 0.6)
  Top 0.254: U4.16 44.1,38.04 v44.1,38.51 | R11.1 85.29,24.64 v84.74,24.09
  Bottom 0.254: v44.1,38.51 44.71,37.9 44.71,5.8 46.13,4.38 75.8,4.38 77.02,3.16 80.47,3.16 81.29,2.34 82.1,2.34 83.12,3.36 83.12,24.52 U$5.P$1 84.74,25.74 v84.74,24.09
ADC3  (via drill 0.6)
  Top 0.254: U4.17 44.45,41.15 v44.91,41.15 | R16.1 85.5,34.6 v84.94,34.04
  Bottom 0.254: v44.91,41.15 45.32,40.75 45.32,6 46.34,4.99 76.21,4.99 77.22,3.97 81.9,3.97 82.51,4.58 82.51,32.82 84.13,34.45 | 84.13,34.45 84.13,36.1 U$6.P$1 | v84.94,34.04 84.54,34.04 84.13,34.45
ADC4  (via drill 0.6)
  Top 0.254: U4.20 43.95,42.78 v44.3,42.78 | R18.1 85.5,47.71 v85.15,48.06
  Bottom 0.254: v44.3,42.78 44.3,43.8 44.91,44.41 44.91,47.25 44.3,47.86 44.3,71.43 45.93,73.06 45.93,74.48 46.54,75.09 46.54,76.71 46.74,76.92 77.02,76.92 78.85,78.75 79.66,78.75 82.91,75.5 82.91,49.89 84.13,48.67 84.54,48.67 v85.15,48.06 84.33,47.25 U$7.P$1
ADC5  (via drill 0.6)
  Top 0.254: U4.21 43.49,43.04 43.49,43.8 43.9,44.2 v43.9,46.23 | R20.1 85.5,57.35 v86.37,58.22 82.51,58.22 82.3,58.43 82.3,77.32 v82.1,77.53
  Bottom 0.254: v43.9,46.23 43.9,47.25 43.7,47.45 43.7,71.84 45.12,73.26 45.12,74.68 45.93,75.5 45.93,77.32 46.13,77.53 76.82,77.53 79.05,79.76 80.07,79.76 80.27,79.56 v82.1,77.53 | v86.37,58.22 85.15,58.22 84.54,57.61 84.54,56.32 U$8.P$1
ADC6  (via drill 0.6)
  Top 0.254: U4.22 42.88,43.15 v42.88,45.02 | v85.15,68.18 85.15,66.28 R22.1 85.02,66.15 83.32,66.15 82.91,66.55 82.91,77.12 v83.32,77.53
  Bottom 0.254: v42.88,45.02 42.88,47.45 43.09,47.66 43.09,72.04 44.1,73.06 44.1,74.89 45.12,75.9 45.12,77.93 45.52,78.34 76.82,78.34 77.02,78.54 77.22,78.75 78.85,80.37 80.88,80.37 83.32,77.93 v83.32,77.53 | U$9.P$1 84.33,67.37 v85.15,68.18
ADC7  (via drill 0.6)
  Top 0.254: U4.23 41.87,42.81 v41.87,43.8 | 85.5,76.16 R24.1 85.42,75.7 v84.34,75.7
  Bottom 0.254: v41.87,43.8 41.87,47.86 42.48,48.47 42.48,72.65 42.88,73.06 42.88,73.87 43.29,74.28 43.29,75.29 44.51,76.51 44.51,78.54 45.12,79.15 76.82,79.15 77.63,79.97 78.65,80.98 81.9,80.98 83.52,79.36 83.52,78.54 84.13,77.93 84.13,76.23 U$10.P$1 | v84.34,75.7 84.34,76.03 U$10.P$1 | 84.74,76.03 U$10.P$1
ADC8  (via drill 0.6)
  Top 0.254: U4.26 41.05,44.16 41.05,46.03 43.7,48.67 v45.12,48.67 | R26.1 82.78,46.55 LED9.K
  Bottom 0.254: 82.3,46.69 LED9.K 82.3,46.9 82.3,75.09 79.86,77.53 79.05,77.53 77.83,76.31 47.35,76.31 47.15,76.11 47.15,74.89 46.54,74.28 46.54,72.85 45.12,71.43 v45.12,48.67
AENBL  (via drill 0.6)
  Top 0.254: IO1.10 15.07,44.03 16.26,45.22 21.55,45.22 25.41,49.08 27.85,49.08 v28.05,48.88 | v31.1,49.89 31.1,48.6 U4.34
  Bottom 0.254: v28.05,48.88 30.08,48.88 v31.1,49.89
APHASE  (via drill 0.6)
  Top 0.254: IO1.13 6.07,45.82 v6.68,46.43 | v25,30.18 26.22,31.4 29.74,31.4 U4.57
  Bottom 0.254: v6.68,46.43 6.78,46.43 7.19,46.83 10.18,46.83 11.39,45.63 11.39,40.34 20.94,30.79 24.39,30.79 v25,30.18
BENBL
  Top 0.254: IO1.11 14.71,44.68 16.06,46.03 21.34,46.03 25.2,49.89 29.08,49.89 U4.35
BOOT  (via drill 0.6)
  Top 0.254: R4.1 41.26,18.85 41.26,17.38 40.58,16.7 40.58,15.49 BOOT.2 | U4.60 32.93,32.47 32.93,31.4 35.77,28.56 v36.79,28.56
  Bottom 0.254: v36.79,28.56 37.8,28.56 38.82,27.54 38.82,23.07 41.26,20.63 41.26,15.35 41.05,15.15 40.23,15.15 BOOT.2
BPHASE  (via drill 0.6)
  Top 0.254: IO1.12 12.57,45.39 v13.62,46.44 | U4.50 29.56,36.19 29.45,36.07 29.05,35.67 21.14,35.67 20.33,34.86 v19.92,34.86
  Bottom 0.254: v13.62,46.44 13.62,40.14 18.7,35.06 19.72,35.06 v19.92,34.86
GND  (via drill 0.6)
  Top 0.254: 9.36,39.48 9.36,39.36 v9.32,39.31 | v9.32,44.19 v9.32,42.97 IO1.PAD 8.92,41.35 | IO1.21 4.95,40.13 4.85,40.03 4.85,37.49 4.6,37.23 3.61,37.23 C4.1 | 39.22,45.83 v39.22,49.69 | U4.31 38.3,44.9 39.22,45.83 | 39.22,45.83 39.83,45.83 40.24,45.42 40.24,44.74 U4.28 | v39.43,40.75 39.63,40.75 40.04,40.34 40.04,37.54 U4.12 42.68,34.89 42.68,34.25 41.66,33.23 41.66,31.81 42.07,31.4 43.29,31.4 43.79,30.9 C21.2 44.82,30.07 45.32,29.57 45.32,24.49 44.91,24.09 42.12,24.09 C22.2 | 35.77,34.25 35.77,33.2 U4.63 | v85.96,49.49 84.13,49.49 83.73,49.08 83.73,44.96 LED9.A | LSM6DS0.P$4 32.83,22.66 | 32.83,22.66 32.83,22.26 | 32.83,22.26 32.83,22.05 | 32.83,22.05 LSM6DS0.P$10 | LSM6DS0.P$15 33.94,22.66 | 33.94,22.66 32.83,22.66 | 32.83,22.26 32.74,22.16 LSM6DS0.P$8 31.19,22.16 31.1,22.26 | LSM6DS0.P$9 32.33,21.55 32.83,22.05 | LSM6DS0.P$11 33.33,21.55 32.83,22.05 | LSM6DS0.P$12 33.83,21.85 | 33.83,21.85 33.83,22.55 33.94,22.66 | LSM6DS0.P$13 34.32,21.36 33.83,21.85 | U4.47 31.78,38.72
  Top 0.305: 9.12,41.14 8.92,41.35 | 9.32,40.13 9.32,39.92 10.42,38.83 | 9.32,40.13 v9.32,40.53 9.32,40.62 9.48,40.78 | 9.22,43.68 9.32,43.58 v9.32,42.97 | 9.32,40.13 | 8.71,40.13 IO1.21 | U$11.P$6 28.18,42.32 U4.47
  Top 0.406: 9.32,39.92 9.12,40.13 8.71,40.13 9.36,39.48 IO1.3 | IO1.2 10.62,38.83 9.32,40.13 | IO1.5 9.48,40.78 9.12,41.14 | IO1.15 8.88,44.03 9.22,43.68 | IO1.8 9.48,42.73 9.32,42.57 | v8.14,54.97 8.14,55.66 X1.5 | USER.1 3.66,32.06 | 3.66,32.06 USER.2 | 3.66,32.06 4.27,31.45 4.27,26.12 3.06,24.91 RESET.1 RESET.2 11.05,24.91 C25.1 | 3.66,32.06 3.66,32.01 v4.68,30.99 | LED11.C 2.5,12.11 LED12.C 2.66,12.08 v3.87,10.88 | 39.63,66.36 40.04,66.77 40.04,68.59 41.26,69.81 43.9,69.81 44.24,69.47 Q2.2 44.24,68.18 | 44.24,68.18 R3.1 | 31.78,38.72 v33.33,38.72 33.33,38.31 33.74,37.9 | 33.74,37.9 35.77,35.87 35.77,34.25 | C26.1 37.37,18.8 37.19,18.8 36.58,18.19 34.14,18.19 33.94,18.4 33.94,19.65 C14.1 32.11,19.82 31.5,20.43 31.5,21.85 31.1,22.26 29.31,22.26 C27.1 29.2,23.75 v28.66,24.29 29.47,25.1 29.47,29.78 v29.06,30.18 | C26.1 39.18,18.9 R4.2 | v33.74,35.87 33.74,37.9 | R30.1 Q3.2 42.75,9.59 41.87,10.47 39.02,10.47 37.8,11.69 37.8,18.56 C26.1 | 44.24,68.18 44.51,68.45 44.51,71.43 45.93,72.85 45.93,76.92 46.54,77.53 78.04,77.53 79.66,79.15 83.52,79.15 v85.15,77.53
  Top 0.61: 40.85,62.14 40.85,52.94 39.22,51.31 v39.22,49.69
  Top 0.813: SV1.4 40.85,62.14 41.05,62.34 41.05,64.52 39.22,66.36 C8.- 39.63,66.36
  Top 1.016: JP1.1 5.49,71.02 5.9,71.43 25.41,71.43 v26.63,70.21 | 9.17,39.16 9.17,37.52 7.53,35.87 6.21,35.87 C2.2
  Top 1.27: 9.32,48.05 v9.32,44.19 | 9.32,42.57 v9.32,42.97 9.32,47.75 v10.24,48.66 9.52,49.37 C7.- | 9.17,39.16 v9.32,39.31
  Bottom 0.254: U$7.P$2 87.98,47.46 v85.96,49.49
  Bottom 0.406: C20.1 6.22,60.96 6.1,61.07 | C16.2 8.45,55.08 v8.14,54.97 6.92,54.77 6.1,53.96 6.1,52.42 | v4.68,30.99 4.68,35.89 | 4.68,35.89 v9.32,40.53 | v3.87,10.88 3.06,10.88 1.43,12.5 1.43,32.64 4.68,35.89 | C1.2 6.72,49.9 7.67,50.85 | U$11.P$6 26.64,41.98 25.61,40.95 16.87,40.95 16.67,40.75 16.67,39.75 U$12.P$6 | v33.33,38.72 33.78,39.16 C6.2 38.6,39.16 C15.2 38.84,40.34 | v39.22,49.69 39.22,47.69 C5.2 | 39.22,46.64 39.22,47.59 C5.2 | v39.43,40.75 39.24,40.75 38.84,40.34 | U$3.P$2 88.82,6.01 89.62,6.81 89.62,16.57 | 89.62,16.57 89.62,26.32 | 89.62,26.32 89.62,36.28 | 89.62,36.28 89.62,46.44 | 89.62,46.44 89.62,56.19 | 89.62,56.19 89.62,65.95 89.21,66.35 88.81,66.35 | 88.81,66.35 88.06,66.35 U$9.P$2 | U$8.P$2 89.54,56.12 89.62,56.19 | U$7.P$2 89.44,46.26 89.62,46.44 | U$6.P$2 89.59,36.31 89.62,36.28 | U$5.P$2 89.24,25.94 89.62,26.32 | U$4.P$2 89.44,16.39 89.62,16.57 | 88.81,66.35 89.42,66.96 89.42,74.48 88.19,75.71 U$10.P$2 87.99,76.02 v87.99,77.73 87.99,78.14 86.57,79.56 85.55,79.56 84.94,78.95 84.94,77.73 v85.15,77.53 | 38.84,40.34 38.84,47.3 C5.2 | v29.06,30.18 29.06,31.2 v33.74,35.87 | v28.66,24.29 27.46,25.48 IC1.7 IC1.2 | IC1.2 IC1.1 19.11,24.13 19.11,23.07 19.92,22.26 C13.1 | IC1.2 IC1.3 IC1.4
  Bottom 0.813: C10.2 20.57,70.86 21.14,71.43 26.83,71.43 40.44,71.43 41.05,70.82 41.05,62.34 SV1.4 | 21.5,66.37 C9.2 | C10.2 C9.2 | C11.2 20.62,69.12 C10.2 | C12.2 20.62,67.24 C9.2
  Bottom 1.016: v10.24,48.66 9.52,49.37 9.15,49.37 7.67,50.85 6.1,52.42 6.1,61.07 6.1,65.54 5.49,66.15 JP1.1 | v26.63,70.21 26.63,71.23 26.83,71.43 | 21.5,61.88 IC2.2 21.5,66.37 | 21.5,61.88 27.03,61.88 27.03,51.31 16.06,51.31 16.06,61.88 21.5,61.88
  Bottom 1.27: 9.63,49.27 v10.24,48.66
  other vias: 9.32,41.75 3.73,47.24 11.86,48.66 26.63,68.38 28.46,70.21 28.46,68.38 7.53,69.4 7.53,66.55 10.24,50.29 11.86,50.29 16.67,70.21 16.67,68.59 9.15,69.4 9.15,66.55 16.26,15.75 16.87,28.56 34.14,52.33 39.63,54.36 13.42,26.73 13.62,21.85 6.92,23.07 36.18,11.49 29.88,62.9 36.18,64.93 38.41,29.98 41.66,22.05 86.16,13.11 84.74,60.46 88.6,49.49 90.63,46.84 26.83,15.96 84.34,69.6 20.94,33.43 12.4,32.62 80.07,4.99 21.55,49.69 41.05,64.93
  pour Top: -23.16,95.21 99.98,95.21 99.98,-9.24 -23.16,-9.24
  pour Bottom: -22.95,87.48 103.44,87.48 103.44,-27.32 -22.95,-27.32
IR_CONTROLL  (via drill 0.6)
  Top 0.254: R3.2 42.34,59.31 41.87,58.83 41.87,49.69 v41.26,49.08 | v30.89,44.61 30.89,43.84 U4.41
  Top 0.406: R3.2 Q2.1
  Bottom 0.254: v41.26,49.08 41.26,50.71 39.83,52.13 37.6,52.13 35.77,50.3 35.77,48.27 31.91,44.41 31.1,44.41 v30.89,44.61
IR_CONTROLL_FRONT
  Top 0.254: R30.2 44.65,12.57 42.68,14.54 42.68,20.23 42.07,20.83 40.85,20.83 38.21,23.48 38.21,28.56 36.58,30.18 36.58,32.42 36.99,32.82 37.67,32.82 U4.2
  Top 0.406: Q3.1 44.65,10.81 44.71,10.88 44.71,11.42 R30.2
IR_LED  (via drill 0.6)
  Top 0.254: v88.81,51.52 89.62,51.52
  Top 0.406: v88.4,12.5 88.81,12.5 89.62,13.32 89.62,21.85 | 89.62,21.85 89.62,32.21 | 89.62,32.21 89.62,41.76 | 89.62,41.76 89.62,51.52 89.62,60.87 | 89.62,60.87 89.62,70.01 89.01,70.62 v88.4,70.62 | v88.81,60.66 89.42,60.66 89.62,60.87 | v89.01,41.76 89.62,41.76 | v88.6,32.21 89.62,32.21 | v88.81,21.85 89.62,21.85 | 43.29,71.03 Q2.3 43.49,71.11 43.49,72.04 45.12,73.67 45.12,77.32 46.13,78.34 77.63,78.34 79.46,80.17 84.34,80.17 v86.16,78.34
  Bottom 0.254: LED6.C 88.19,52.13 v88.81,51.52
  Bottom 0.406: LED1.C 88.32,12.42 v88.4,12.5 | LED7.C 88.19,61.28 v88.81,60.66 | LED5.C 88.09,42.68 v89.01,41.76 88.09,40.84 LED4.C | LED3.C 88.29,31.9 v88.6,32.21 | LED2.C 88.29,21.34 v88.81,21.85 | v88.4,70.62 88.4,72.77 88.6,72.97 LED8.C 88.07,73.26 86.98,73.26 86.37,73.87 86.37,78.14 v86.16,78.34
IR_LED_FRONT
  Top 0.406: Q3.3 43.7,5.39 45.32,3.77 82.3,3.77 83.52,4.99 83.52,35.21 LED10.K
LED_1  (via drill 0.6)
  Top 0.254: R28.2 14.13,30.49 19.92,36.28 27.24,36.28 v28.46,37.5 | v35.36,42.37 35.36,42.93 U4.36
  Bottom 0.254: v28.46,37.5 30.49,37.5 v35.36,42.37
LEFT_ENC
  Top 0.254: U$11.P$4 22.64,45.3 25.2,47.86 29.71,47.86 U4.37
LEFT_ENC_B
  Top 0.254: U$11.P$5 24.64,46.08 25.61,47.05 29.81,47.05 U4.38
M1  (via drill 0.6)
  Top 0.254: IO1.14 5.03,44.68 4.85,44.85 4.85,45.87 5.36,46.38 5.36,47.34 v5.46,47.44 | v25.2,32.01 29.63,32.01 U4.56
  Bottom 0.254: v5.46,47.44 10.79,47.44 12,46.23 12,40.75 21.34,31.4 24.59,31.4 v25.2,32.01
N$1
  Top 0.406: IO1.6 14.57,41.43 15.25,40.75 15.25,38.92 15.86,38.31 23.23,38.31 U$12.P$2
N$2
  Top 0.406: IO1.4 14.04,40.13 14.43,39.73 14.43,38.51 15.45,37.5 25.2,37.5 26.63,38.92 26.63,39.71 U$12.P$1
N$3
  Top 0.406: IO1.7 16.4,42.08 U$11.P$1
N$4
  Top 0.406: IO1.9 15.44,43.38 16.06,44 18.3,44 18.7,43.59 18.7,42.38 U$11.P$2
N$5
  Top 0.254: IO1.17 5.2,42.73 4.85,43.07 4.85,43.33 4.34,43.84 3.84,43.84 3.58,44.09 3.58,44.88 C3.2
N$6
  Top 0.254: LSM6DS0.P$14 35.66,22.16 35.97,21.85 35.97,19.98 C14.2
N$7
  Top 0.254: R29.1 84.54,41.76 82.71,39.94 82.71,38.97 LED10.A
N$8
  Top 0.305: IO1.24 IO1.23 IO1.22
N$9
  Top 0.406: R1.2 12.75,38 IO1.1
N$14  (via drill 0.6)
  Top 0.254: v85.55,11.28 85.55,8.98 R5.1
  Bottom 0.254: LED1.A 84.82,10.55 v85.55,11.28
N$15  (via drill 0.6)
  Top 0.406: R10.1 85.7,20.08 v84.54,21.24
  Bottom 0.406: v84.54,21.24 84.54,19.59 LED2.A
N$16  (via drill 0.6)
  Top 0.254: R12.1 85.5,30.85 v84.74,31.6
  Bottom 0.254: v84.74,31.6 84.74,29.34 LED3.A
N$17  (via drill 0.6)
  Top 0.254: R17.1 85.5,39.18 v84.54,40.14
  Bottom 0.254: 84.94,39.2 LED4.A 84.54,38.89 v84.54,40.14
N$18  (via drill 0.6)
  Top 0.254: R19.1 84.71,43.77 v83.12,42.17
  Bottom 0.254: LED5.A 84.59,43.64 v83.12,42.17
N$19  (via drill 0.6)
  Top 0.254: 85.55,53.16 R21.1 86.37,52.35 v86.37,51.52
  Bottom 0.254: LED6.A 84.69,53.19 v86.37,51.52
N$20  (via drill 0.6)
  Top 0.254: v85.96,61.47 85.96,63.12 R23.1
  Bottom 0.254: LED7.A 84.69,62.74 v85.96,61.47
N$21  (via drill 0.6)
  Top 0.254: R25.1 85.09,71.9 v85.76,71.23
  Bottom 0.254: v85.76,71.23 85.76,72.32 LED8.A
N$22
  Top 0.254: IO1.20 4.36,40.78 C4.2
N$23
  Top 0.406: LED12.A 2.47,17.87 R27.2
N$33  (via drill 0.6)
  Top 0.254: R28.1 11.98,27.52 v11.39,26.93 | v6.92,15.96 5.7,15.96 LED11.A
  Bottom 0.254: v11.39,26.93 7.12,26.93 5.09,24.9 5.09,17.79 v6.92,15.96
N$55  (via drill 0.6)
  Top 0.254: R7.1 10.99,59.79 C20.2 12.16,62.45 v12.4,62.69
  Top 0.406: X1.2 10.44,58.39 R7.1
  Bottom 0.254: v12.4,62.69 12.4,61.2 C20.2
N$56  (via drill 0.6)
  Top 0.254: v13.82,54.77 11.39,54.77 10.98,55.18 10.98,56.97 R8.1
  Top 0.406: X1.3 10.36,57.59 R8.1
  Bottom 0.254: C16.1 13.51,55.08 v13.82,54.77
N$57  (via drill 0.6)
  Top 0.406: X1.1 7.81,59.32 8.95,60.46 9.76,60.46 10.98,61.68 v10.98,63.71
  Bottom 0.406: v10.98,63.71 8.24,63.71 D1.A
OSCIN
  Top 0.254: U4.5 40.24,32.38 40.24,29.78 41.46,28.56 41.46,26.73 40.42,25.69 Q1.3 40.36,24.97 C22.1
OSCOUT
  Top 0.254: U4.6 41.05,32.28 41.05,30.59 41.57,30.07 C21.1 42.09,28.34 42.48,27.95 43.9,27.95 Q1.1
RESET  (via drill 0.6)
  Top 0.254: C25.2 26.57,23.54 v27.64,22.46 | v38.62,36.07 38.62,35.4 U4.7
  Top 0.406: RESET.3 RESET.4 9.37,21.06 10.17,21.85 11.28,21.85 R15.1 11.39,23.53 C25.2
  Bottom 0.254: v27.64,22.46 30.69,22.46 32.11,23.88 37.4,23.88 38.01,24.49 38.01,26.73 37.4,27.34 35.97,27.34 35.77,27.54 35.77,30.59 39.02,33.84 39.02,35.67 v38.62,36.07
RIGHT_ENC  (via drill 0.6)
  Top 0.254: U4.53 28.93,33.43 v25,33.43
  Bottom 0.254: U$12.P$4 20.64,37.79 v25,33.43
RIGHT_ENC_B  (via drill 0.6)
  Top 0.254: v23.17,33.03 23.17,33.64 23.78,34.25 29.02,34.25 U4.52
  Bottom 0.254: U$12.P$5 18.64,37.56 v23.17,33.03
SCL  (via drill 0.6)
  Top 0.254: 37.48,25.22 R14.1 36.87,26.03 v36.58,26.32 | v31.1,29.78 31.1,32.04 U4.58 | LSM6DS0.P$2 33.83,25.01 33.54,25.31 31.5,25.31 v31.1,25.71
  Bottom 0.254: 31.1,26.93 v31.1,25.71 30.06,26.75 IC1.6 | 31.1,26.93 v31.1,29.78 | v36.58,26.32 31.71,26.32 31.1,26.93
SDA  (via drill 0.6)
  Top 0.254: 32.77,28.15 R13.1 31.98,26.46 31.71,26.73 30.69,26.73 30.28,26.32 30.28,24.9 30.49,24.7 33.13,24.7 33.33,24.49 LSM6DS0.P$3 | 32.77,28.15 32.77,29.53 32.32,29.98 32.32,32.58 U4.59 | v32.11,28.35 32.56,28.35 32.77,28.15
  Bottom 0.254: IC1.5 29.75,28.02 30.08,28.35 30.08,30.39 30.49,30.79 32.32,30.79 33.33,29.78 33.33,29.57 v32.11,28.35
UART_RX  (via drill 0.6)
  Top 0.254: SV1.2 35.72,51.87 v32.72,48.88 | v27.85,46.23 27.85,45.49 U4.43
  Bottom 0.254: v32.72,48.88 31.71,48.88 28.66,45.83 28.25,45.83 v27.85,46.23
UART_TX  (via drill 0.6)
  Top 0.254: SV1.3 38.26,60.71 36.58,59.04 36.58,51.72 34.96,50.1 34.96,49.28 v33.74,48.06 | v29.67,45.42 29.67,44.34 U4.42
  Bottom 0.254: v33.74,48.06 33.33,47.66 31.91,47.66 v29.67,45.42
USBDM  (via drill 0.6)
  Top 0.254: R7.2 13.11,58.94 15.45,56.6 15.45,51.72 18.9,48.27 v20.12,48.27 | v26.63,45.83 26.79,45.83 U4.44
  Bottom 0.254: v20.12,48.27 24.19,48.27 v26.63,45.83
USBDP  (via drill 0.6)
  Top 0.254: R8.2 13.82,57.01 14.84,55.99 14.84,53.96 | 14.84,53.96 14.03,53.14 12.33,53.14 R9.2 | 14.84,53.96 14.84,51.31 v19.11,47.05 | v26.22,44.41 27.49,44.41 U4.45
  Bottom 0.254: v19.11,47.05 23.58,47.05 v26.22,44.41
USER_KEY_1  (via drill 0.6)
  Top 0.254: USER.3 2.26,27.56 v3.26,28.56 | v15.86,33.84 16.26,33.84 19.31,36.89 26.02,36.89 v27.85,38.72 | v36.79,43.39 36.79,43.62 U4.33
  Bottom 0.254: v3.26,28.56 7.12,28.56 7.93,29.37 11.39,29.37 v15.86,33.84 | v27.85,38.72 30.49,38.72 35.57,43.8 36.38,43.8 v36.79,43.39
VCC  (via drill 0.6)
  Top 0.254: C7.+ 2.45,49.37 2.01,49.37 1.9,49.27
  Top 0.305: 3.33,42.08 C3.1
  Top 0.406: IO1.18 3.58,42.08 C3.1 4.23,41.43 IO1.19 | R1.1 9.14,34.64 7.93,33.43 3.26,33.43 2.85,33.84 2.85,35.29 C2.1 2.41,35.3 2.06,34.95 | v1.23,50.91 1.23,50.59 2.45,49.37
  Top 0.61: 1.9,49.27 1.9,48.76
  Top 1.016: C7.+ 3.06,49.89 4.27,51.11 4.27,54.36 3.26,55.38 3.26,59.85 4.48,61.07 4.48,64.12 3.06,65.54 3.06,67.82 JP1.2
  Top 1.27: 3.2,42.16 C3.1 3.1,42.31 1.8,42.31 1.55,42.57 | 1.55,42.57 1.55,48.41 1.9,48.76 | 2.06,34.95 1.55,35.45 1.55,42.57
  Bottom 0.406: C1.1 2.33,49.8 v1.23,50.91
  Bottom 0.813: IC2.1 18.96,67.21 C9.1 C10.1
  Bottom 1.016: D1.C 2.95,63.81 1.84,64.93 1.84,66.81 2.42,67.39 | 2.42,67.39 JP1.2 | IC2.1 18.96,70.97 18.5,71.43 3.87,71.43 2.24,69.81 2.24,67.57 2.42,67.39